# EAGLE schematic power_board (EAGLE 7.6.0)
DRAWING_TITLE: power_board; REVISION: 1.0
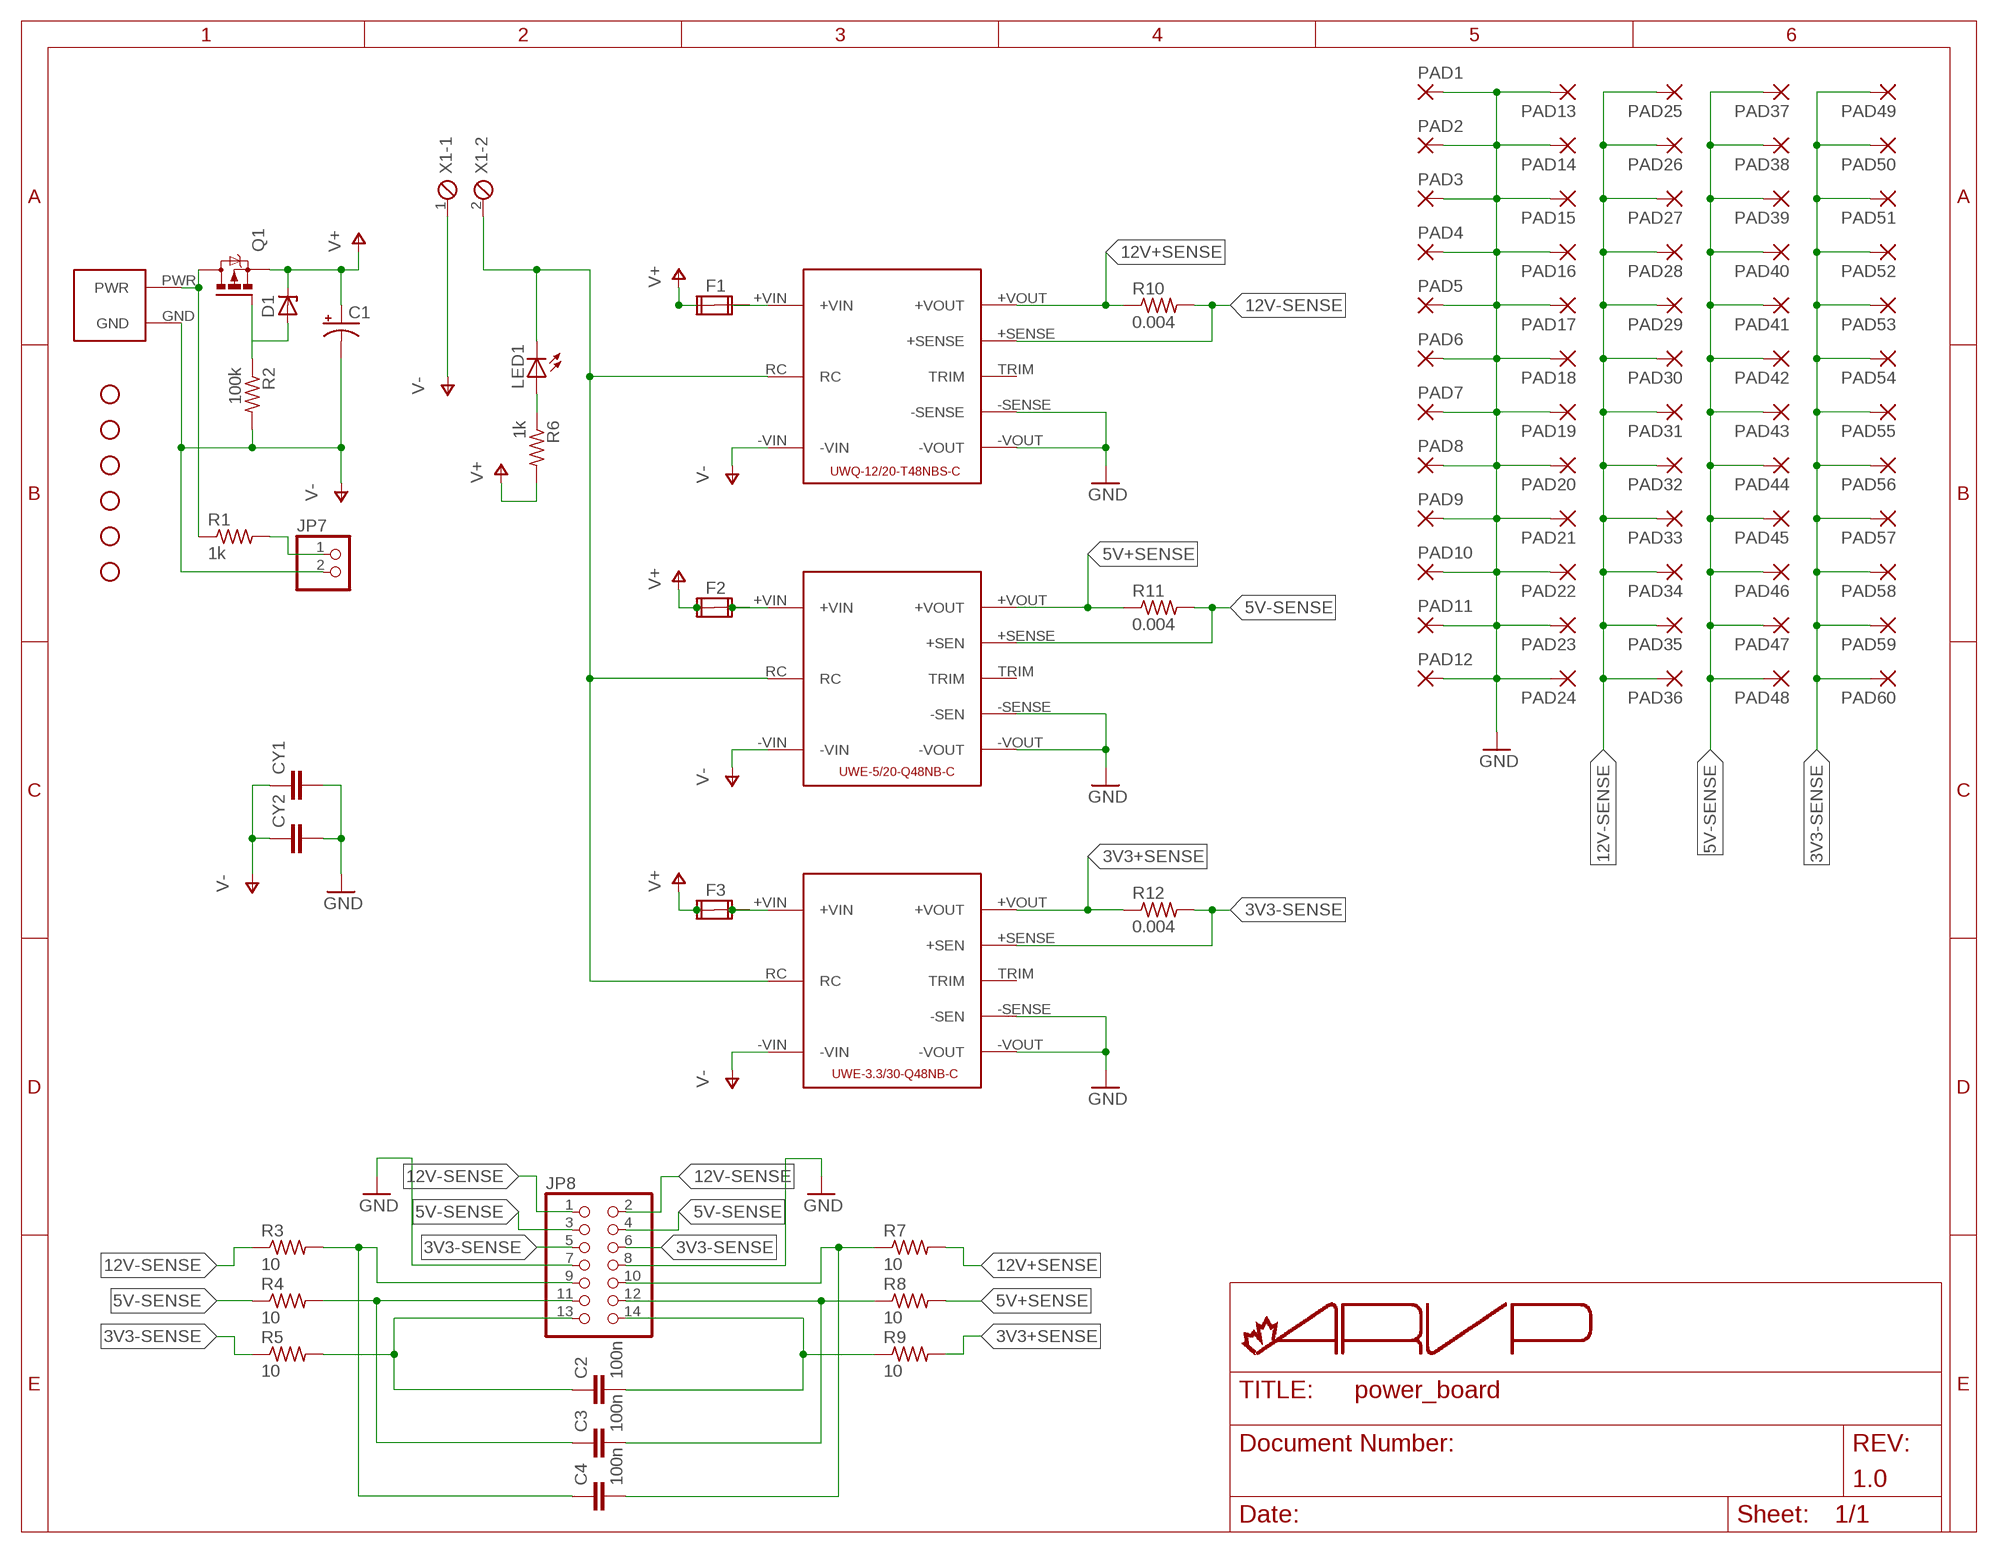
[diagram p0: schematic, sheet 1]

## Parts
C1  CPOL-USE5-10.5  [E5-10,5]
C2  100n  C-EU025-024X044  [C025-024X044]
C3  100n  C-EU025-024X044  [C025-024X044]
C4  100n  C-EU025-024X044  [C025-024X044]
CY1  CYYC7B5  [YC7B5]
CY2  CYYC7B5  [YC7B5]
D1  ZENER-DIODEDO35Z10  [DO35Z10]
F1  FUSE2P  [FUSE1]
F2  FUSE2P  [FUSE1]
F3  FUSE2P  [FUSE1]
JP1  STAND-OFF  [STAND-OFF]
JP2  STAND-OFF  [STAND-OFF]
JP3  STAND-OFF  [STAND-OFF]
JP4  STAND-OFF  [STAND-OFF]
JP5  STAND-OFF  [STAND-OFF]
JP6  STAND-OFF  [STAND-OFF]
JP7  PINHD-1X2  [1X02]
JP8  PINHD-2X7  [2X07]
LED1  LED3MM  [LED3MM]
P$1  AND_PWR  [AND_PWR]
PAD1  WIREPAD3,17/1,3  [3,17/1,3]
PAD2  WIREPAD3,17/1,3  [3,17/1,3]
PAD3  WIREPAD3,17/1,3  [3,17/1,3]
PAD4  WIREPAD3,17/1,3  [3,17/1,3]
PAD5  WIREPAD3,17/1,3  [3,17/1,3]
PAD6  WIREPAD3,17/1,3  [3,17/1,3]
PAD7  WIREPAD3,17/1,3  [3,17/1,3]
PAD8  WIREPAD3,17/1,3  [3,17/1,3]
PAD9  WIREPAD3,17/1,3  [3,17/1,3]
PAD10  WIREPAD3,17/1,3  [3,17/1,3]
PAD11  WIREPAD3,17/1,3  [3,17/1,3]
PAD12  WIREPAD3,17/1,3  [3,17/1,3]
PAD13  WIREPAD3,17/1,3  [3,17/1,3]
PAD14  WIREPAD3,17/1,3  [3,17/1,3]
PAD15  WIREPAD3,17/1,3  [3,17/1,3]
PAD16  WIREPAD3,17/1,3  [3,17/1,3]
PAD17  WIREPAD3,17/1,3  [3,17/1,3]
PAD18  WIREPAD3,17/1,3  [3,17/1,3]
PAD19  WIREPAD3,17/1,3  [3,17/1,3]
PAD20  WIREPAD3,17/1,3  [3,17/1,3]
PAD21  WIREPAD3,17/1,3  [3,17/1,3]
PAD22  WIREPAD3,17/1,3  [3,17/1,3]
PAD23  WIREPAD3,17/1,3  [3,17/1,3]
PAD24  WIREPAD3,17/1,3  [3,17/1,3]
PAD25  WIREPAD3,17/1,3  [3,17/1,3]
PAD26  WIREPAD3,17/1,3  [3,17/1,3]
PAD27  WIREPAD3,17/1,3  [3,17/1,3]
PAD28  WIREPAD3,17/1,3  [3,17/1,3]
PAD29  WIREPAD3,17/1,3  [3,17/1,3]
PAD30  WIREPAD3,17/1,3  [3,17/1,3]
PAD31  WIREPAD3,17/1,3  [3,17/1,3]
PAD32  WIREPAD3,17/1,3  [3,17/1,3]
PAD33  WIREPAD3,17/1,3  [3,17/1,3]
PAD34  WIREPAD3,17/1,3  [3,17/1,3]
PAD35  WIREPAD3,17/1,3  [3,17/1,3]
PAD36  WIREPAD3,17/1,3  [3,17/1,3]
PAD37  WIREPAD3,17/1,3  [3,17/1,3]
PAD38  WIREPAD3,17/1,3  [3,17/1,3]
PAD39  WIREPAD3,17/1,3  [3,17/1,3]
PAD40  WIREPAD3,17/1,3  [3,17/1,3]
PAD41  WIREPAD3,17/1,3  [3,17/1,3]
PAD42  WIREPAD3,17/1,3  [3,17/1,3]
PAD43  WIREPAD3,17/1,3  [3,17/1,3]
PAD44  WIREPAD3,17/1,3  [3,17/1,3]
PAD45  WIREPAD3,17/1,3  [3,17/1,3]
PAD46  WIREPAD3,17/1,3  [3,17/1,3]
PAD47  WIREPAD3,17/1,3  [3,17/1,3]
PAD48  WIREPAD3,17/1,3  [3,17/1,3]
PAD49  WIREPAD3,17/1,3  [3,17/1,3]
PAD50  WIREPAD3,17/1,3  [3,17/1,3]
PAD51  WIREPAD3,17/1,3  [3,17/1,3]
PAD52  WIREPAD3,17/1,3  [3,17/1,3]
PAD53  WIREPAD3,17/1,3  [3,17/1,3]
PAD54  WIREPAD3,17/1,3  [3,17/1,3]
PAD55  WIREPAD3,17/1,3  [3,17/1,3]
PAD56  WIREPAD3,17/1,3  [3,17/1,3]
PAD57  WIREPAD3,17/1,3  [3,17/1,3]
PAD58  WIREPAD3,17/1,3  [3,17/1,3]
PAD59  WIREPAD3,17/1,3  [3,17/1,3]
PAD60  WIREPAD3,17/1,3  [3,17/1,3]
Q1  IPP80P03P4L04AKSA1  [TO220BV]
R1  1k  R-US_0204/7  [0204/7]
R2  100k  R-US_0204/7  [0204/7]
R3  10  R-US_0204/5  [0204/5]
R4  10  R-US_0204/5  [0204/5]
R5  10  R-US_0204/5  [0204/5]
R6  1k  R-US_0204/7  [0204/7]
R7  10  R-US_0204/5  [0204/5]
R8  10  R-US_0204/5  [0204/5]
R9  10  R-US_0204/5  [0204/5]
R10  0.004  R-US_0617/22  [0617/22]
R11  0.004  R-US_0617/22  [0617/22]
R12  0.004  R-US_0617/22  [0617/22]
U1  UWQ-12/20-T48NBS-C  [UWQ-12/20-T48]
U2  UWE-5/20-Q48NB-C  [UWE-100-120W]
U3  UWE-3.3/30-Q48NB-C  [UWE-100-120W]
X1  MPT2  [2POL254]

## Nets
3V3+SENSE: R9.2 R12.1 U3.+VOUT
3V3-SENSE: JP8.5 JP8.6 PAD49.1(P) PAD50.1(P) PAD51.1(P) PAD52.1(P) PAD53.1(P) PAD54.1(P) PAD55.1(P) PAD56.1(P) PAD57.1(P) PAD58.1(P) PAD59.1(P) PAD60.1(P) R5.1 R12.2 U3.+SENSE(+SEN)
5V+SENSE: R8.2 R11.1 U2.+VOUT
5V-SENSE: JP8.3 JP8.4 PAD37.1(P) PAD38.1(P) PAD39.1(P) PAD40.1(P) PAD41.1(P) PAD42.1(P) PAD43.1(P) PAD44.1(P) PAD45.1(P) PAD46.1(P) PAD47.1(P) PAD48.1(P) R4.1 R11.2 U2.+SENSE(+SEN)
12V+SENSE: R7.2 R10.1 U1.+VOUT
12V-SENSE: JP8.1 JP8.2 PAD25.1(P) PAD26.1(P) PAD27.1(P) PAD28.1(P) PAD29.1(P) PAD30.1(P) PAD31.1(P) PAD32.1(P) PAD33.1(P) PAD34.1(P) PAD35.1(P) PAD36.1(P) R3.1 R10.2 U1.+SENSE
GND: CY1.2 CY2.2 JP8.7 JP8.8 PAD1.1(P) PAD2.1(P) PAD3.1(P) PAD4.1(P) PAD5.1(P) PAD6.1(P) PAD7.1(P) PAD8.1(P) PAD9.1(P) PAD10.1(P) PAD11.1(P) PAD12.1(P) PAD13.1(P) PAD14.1(P) PAD15.1(P) PAD16.1(P) PAD17.1(P) PAD18.1(P) PAD19.1(P) PAD20.1(P) PAD21.1(P) PAD22.1(P) PAD23.1(P) PAD24.1(P) U1.-SENSE U1.-VOUT U2.-SENSE(-SEN) U2.-VOUT U3.-SENSE(-SEN) U3.-VOUT
J3: C4.1 JP8.9 R3.2
J4: C4.2 JP8.10 R7.1
J5: C3.1 JP8.11 R4.2
J6: C3.2 JP8.12 R8.1
J7: C2.1 JP8.13 R5.2
J8: C2.2 JP8.14 R9.1
N$1: LED1.A R6.1
N$2: JP7.1 R1.2
N$4: D1.A Q1.G R2.1
N$5: F1.2A F1.2B U1.+VIN
N$6: F2.2A F2.2B U2.+VIN
N$7: F3.2A F3.2B U3.+VIN
ON/OFF: LED1.K(C) U1.RC U2.RC U3.RC X1.2
V+: C1.+ D1.C F1.1A F1.1B F2.1A F2.1B F3.1A F3.1B Q1.S R6.2
V-: C1.- CY1.1 CY2.1 JP7.2 P$1.GND R2.2 U1.-VIN U2.-VIN U3.-VIN X1.1
VBAT+: P$1.PWR Q1.D R1.1
Unconnected: U1.TRIM U2.TRIM U3.TRIM

## Library data of the parts
C1 = rcl:CPOL-US: POLARIZED CAPACITOR, American symbol
C2-C4 = rcl:C-EU: CAPACITOR, European symbol
CY1 CY2 = rcl:CY: Y CAPACITOR for power line
D1 = diode:ZENER-DIODE: Z-Diode
F1-F3 = special:FUSE2P: FUSE 5 x 20 mm
JP1-JP6 = SparkFun:STAND-OFF: Stand Off This is the mechanical footprint for a #4 phillips button head screw. Use the keepout ring to avoid running the screw head into surrounding components. SKU : PRT-00447
JP7 = pinhead:PINHD-1X2: PIN HEADER
JP8 = pinhead:PINHD-2X7: PIN HEADER
LED1 = led:LED: LED OSRAM: - CHIPLED LG R971, LG N971, LY N971, LG Q971, LY Q971, LO R971, LY R971 LH N974, LH R974 LS Q976, LO Q976, LY Q976 LO Q996 - Hyper CHIPLED LW Q18S LB Q993, LB Q99A, LB R99A - SideLED LS A670, LO A670, LY A670, LG A670, LP A670 LB A673, LV A673, LT A673, LW A673 LH A674 LY A675 LS A676, LA A676, LO A676, LY A676, LW A676 LS A679, LY A679, LG A679 - Hyper Micro SIDELED® LS Y876, LA Y876, LO Y876, LY Y876 LT Y87S - SmartLED LW L88C, LW L88S LB L89C, LB L89S, LG L890 LS L89K, LO L89K, LY L89K LS L896, LA L896, LO L896, LY L896 - TOPLED LS T670, LO T670, LY T670, LG T670, LP T670 LSG T670, LSP T670, LSY T670, LOP T670, LYG T670 LG T671, LOG T671, LSG T671 LB T673, LV T673, LT T673, LW T673 LH T674 LS T676, LA T676, LO T676, LY T676, LB T676, LH T676, LSB T676, LW T676 LB T67C, LV T67C, LT T67C, LS T67K, LO T67K, LY T67K, LW E67C LS E67B, LA E67B, LO E67B, LY E67B, LB E67C, LV E67C, LT E67C LW T67C LS T679, LY T679, LG T679 LS T770, LO T770, LY T770, LG T770, LP T770 LB T773, LV T773, LT T773, LW T773 LH T774 LS E675, LA E675, LY E675, LS T675 LS T776, LA T776, LO T776, LY T776, LB T776 LHGB T686 LT T68C, LB T68C - Hyper Mini TOPLED® LB M676 - Mini TOPLED Santana® LG M470 LS M47K, LO M47K, LY M47K Source: http://www.osram.convergy.de LUXEON: - LUMILED® LXK2-PW12-R00, LXK2-PW12-S00, LXK2-PW14-U00, LXK2-PW14-V00 LXK2-PM12-R00, LXK2-PM12-S00, LXK2-PM14-U00 LXK2-PE12-Q00, LXK2-PE12-R00, LXK2-PE12-S00, LXK2-PE14-T00, LXK2-PE14-U00 LXK2-PB12-K00, LXK2-PB12-L00, LXK2-PB12-M00, LXK2-PB14-N00, LXK2-PB14-P00, LXK2-PB14-Q00 LXK2-PR12-L00, LXK2-PR12-M00, LXK2-PR14-Q00, LXK2-PR14-R00 LXK2-PD12-Q00, LXK2-PD12-R00, LXK2-PD12-S00 LXK2-PH12-R00, LXK2-PH12-S00 LXK2-PL12-P00, LXK2-PL12-Q00, LXK2-PL12-R00 Source: www.luxeon.com KINGBRIGHT: KA-3528ASYC Source: www.kingbright.com
P$1 = ARVP:AND_PWR
PAD1-PAD60 = wirepad:WIREPAD: Wire PAD connect wire on PCB
Q1 = transistor-power:IPP80P03P4L04AKSA1: P-CHANNEL MOS-FET SYMBOL
R1 R2 R6 = resistor:R-US_: RESISTOR, American symbol
R3-R5 R7-R12 = rcl:R-US_: RESISTOR, American symbol
U1 = New Power Board Library:UWQ-12/20-T48NBS-C
U2 = New Power Board Library:UWE-5/20-Q48NB-C
U3 = New Power Board Library:UWE-3.3/30-Q48NB-C
X1 = con-phoenix-254:MPT2: PHOENIX CONNECTOR; OC_FARNELL: unknown; OC_NEWARK: unknown

## Net classes
0 default: clearance 0.205 mm